# EAGLE design mcp2515-dip (EAGLE 7.4.0)
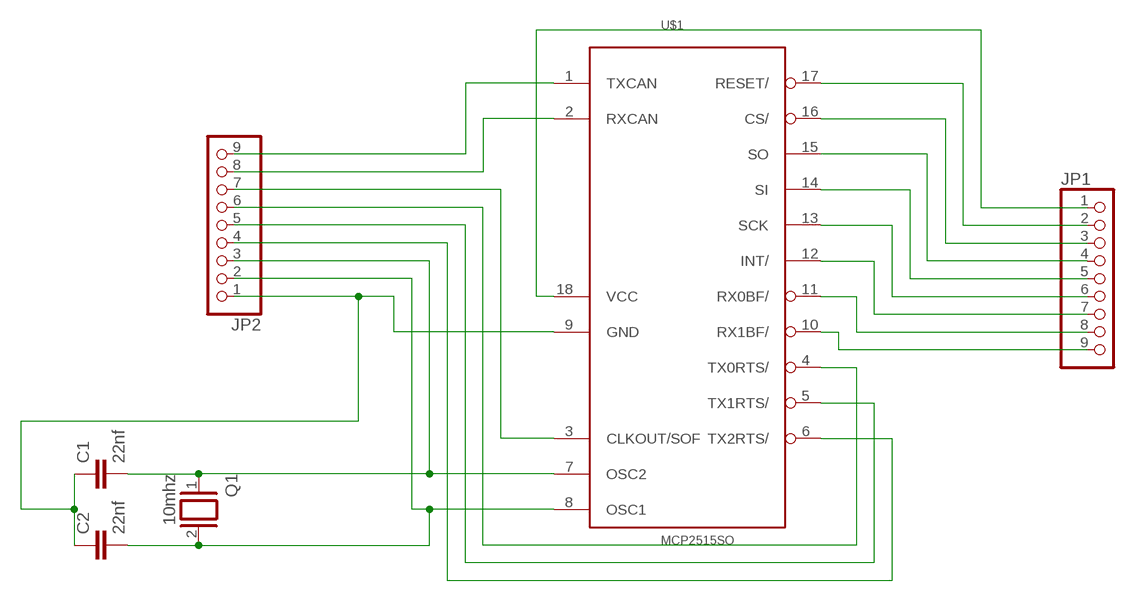
[diagram p0: schematic, sheet 1]

## Parts
C1  22nf  C-EU050-035X075  [C050-035X075]
C2  22nf  C-EU050-035X075  [C050-035X075]
JP1  PINHD-1X9  [1X09]
JP2  PINHD-1X9  [1X09]
Q1  10mhz  XTAL/S  [QS]
U$1  MCP2515SO  [SO18L]

## Nets
GND: C1.1 C2.1 JP2.1 U$1.9(GND)
N$1: JP2.9 U$1.1(TXCAN)
N$2: JP2.8 U$1.2(RXCAN)
N$3: JP2.7 U$1.3(CLKOUT/SOF)
N$4: JP2.6 U$1.4(TX0RTS/)
N$5: JP2.5 U$1.5(TX1RTS/)
N$6: JP2.4 U$1.6(TX2RTS/)
N$7: C1.2 JP2.3 Q1.1 U$1.7(OSC2)
N$9: JP1.9 U$1.10(RX1BF/)
N$10: JP1.8 U$1.11(RX0BF/)
N$11: JP1.7 U$1.12(INT/)
N$12: JP1.6 U$1.13(SCK)
N$13: JP1.5 U$1.14(SI)
N$14: JP1.4 U$1.15(SO)
N$15: JP1.3 U$1.16(CS/)
N$16: JP1.2 U$1.17(RESET/)
N$17: JP1.1 U$1.18(VCC)
N$20: C2.2 JP2.2 Q1.2 U$1.8(OSC1)

## Library data of the parts
C1 C2 = rcl:C-EU: CAPACITOR, European symbol
JP1 JP2 = pinhead:PINHD-1X9: PIN HEADER
Q1 = special:XTAL/S: CRYSTAL
U$1 = MCP2515_MT:MCP2515*: MCP2515 Standalone CAN-Controller by Microchip Eagle-Lib. by MartinThomas

## Board
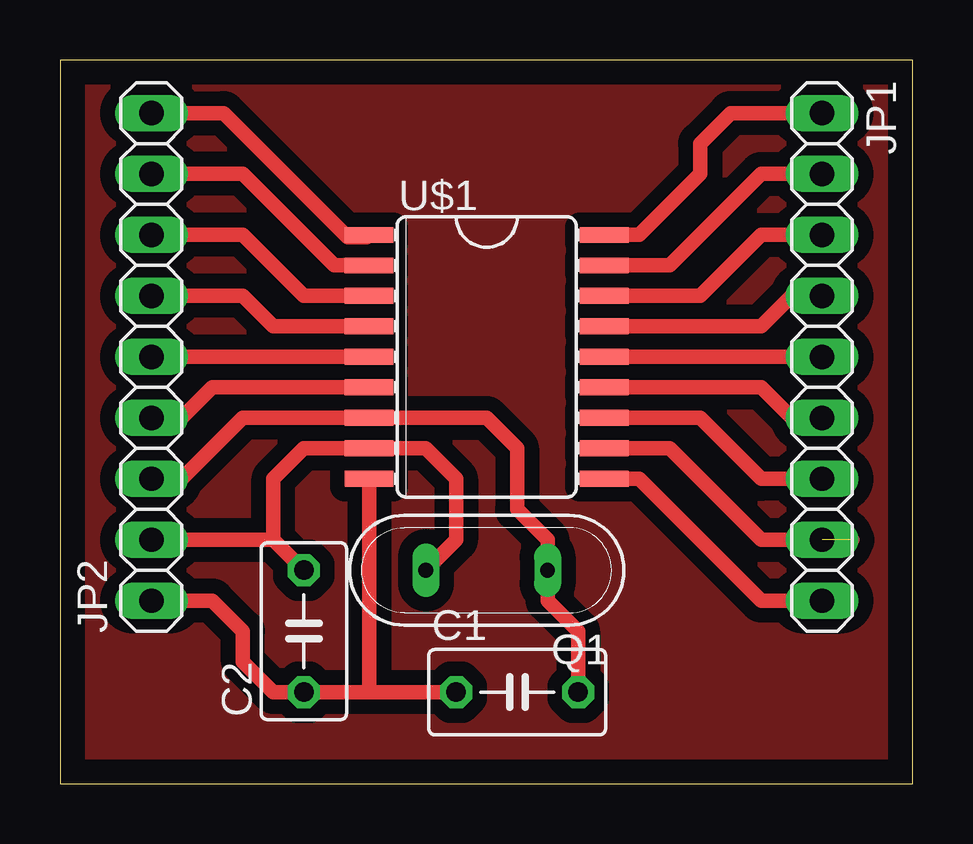
[diagram p1: board, top side]

Size 35.54 x 30.15 mm. Coordinates in mm from the lower left corner, seen from the top.
Outline: 0,0 35.54,0 35.54,30.15 0,30.15 0,0
Copper layers (1*16): Top 0.035mm / dielectric 1.5mm / Bottom 0.035mm
Design rules "default": minimum track width 10mil, minimum drill 24mil, track to track 8mil, track to pad 8mil, pad to pad 8mil, via to via 8mil, smd to smd 8mil, copper to edge 40mil, drill to drill 8mil, minimum pad ring 10mil, minimum via ring 8mil, stop-mask expansion 4mil, vias tented up to drill 0mil, thermal gap 10mil

### Footprints (pad centres in the part's own frame; a part is rotated, then mirrored left to right if it is on the bottom)
C050-035X075 = drill 0.813 octagon: 1 -2.54,0; 2 2.54,0
1X09 = drill 1.016 long: 1 -10.16,0; 2 -7.62,0; 3 -5.08,0; 4 -2.54,0; 5 0,0; 6 2.54,0; 7 5.08,0; 8 7.62,0; 9 10.16,0
QS = drill 0.61 long: 1 -2.54,0; 2 2.54,0
SO18L = smd 0.66 x 2.032: 1 -5.08,-4.902; 2 -3.81,-4.902; 3 -2.54,-4.902; 4 -1.27,-4.902; 5 0,-4.902; 6 1.27,-4.902; 7 2.54,-4.902; 8 3.81,-4.902; 9 5.08,-4.902; 10 5.08,4.902; 11 3.81,4.902; 12 2.54,4.902; 13 1.27,4.902; 14 0,4.902; 15 -1.27,4.902; 16 -2.54,4.902; 17 -3.81,4.902; 18 -5.08,4.902

### Placement (x,y rotation side)
C1  19.05,3.81 0 top
C2  10.16,6.35 90 top
JP1  31.75,17.78 270 top
JP2  3.81,17.78 90 top
Q1  17.78,8.89 180 top
U$1  17.78,17.78 270 top

### Tracks (layer width: path | path; a pad name or v marks a point on that pad's centre or on a via)
GND
  Top 0.61: C1.1 12.7,3.81 | 12.7,3.81 C2.1 8.89,3.81 7.62,5.08 7.62,6.35 6.35,7.62 JP2.1 | U$1.9 12.88,3.99 12.7,3.81
N$1
  Top 0.61: JP2.9 6.81,27.94 11.77,22.98 | 11.77,22.98 | 11.77,22.98 12,22.76 12.77,22.76 U$1.1
N$2
  Top 0.61: U$1.2 11.43,21.59 7.62,25.4 JP2.8
N$3
  Top 0.61: U$1.3 10.16,20.32 7.62,22.86 JP2.7
N$4
  Top 0.61: U$1.4 8.89,19.05 7.62,20.32 JP2.6
N$5
  Top 0.61: U$1.5 JP2.5
N$6
  Top 0.61: JP2.4 5.08,15.24 6.35,16.51 U$1.6
N$7
  Top 0.61: JP2.3 5.08,12.7 7.62,15.24 U$1.7 17.78,15.24 19.05,13.97 19.05,11.43 20.32,10.16 Q1.1 20.32,7.62 21.59,6.35 C1.2
N$8
  pour Top (isolate 0.61): 0,30.48 35.56,30.48 35.56,0 0,0
N$9
  Top 0.61: JP1.9 29.21,7.62 24.13,12.7 U$1.10
N$10  (1 unrouted)
  Top 0.61: U$1.11 25.4,13.97 29.21,10.16 33.02,10.16
N$11
  Top 0.61: JP1.7 29.21,12.7 26.67,15.24 U$1.12
N$12
  Top 0.61: U$1.13 29.21,16.51 30.48,15.24 JP1.6
N$13
  Top 0.61: JP1.5 U$1.14
N$14
  Top 0.61: U$1.15 29.21,19.05 30.48,20.32 JP1.4
N$15
  Top 0.61: U$1.16 26.67,20.32 29.21,22.86 JP1.3
N$16
  Top 0.61: U$1.17 25.4,21.59 29.21,25.4 JP1.2
N$17
  Top 0.61: JP1.1 27.94,27.94 26.67,26.67 26.67,25.4 24.13,22.86 U$1.18
N$20
  Top 0.61: JP2.2 8.89,10.16 | Q1.2 16.51,10.16 16.51,12.7 15.24,13.97 U$1.8 10.16,13.97 8.89,12.7 8.89,10.16 | C2.2 8.89,10.16